# EAGLE design schema2 (EAGLE 7.7.0)
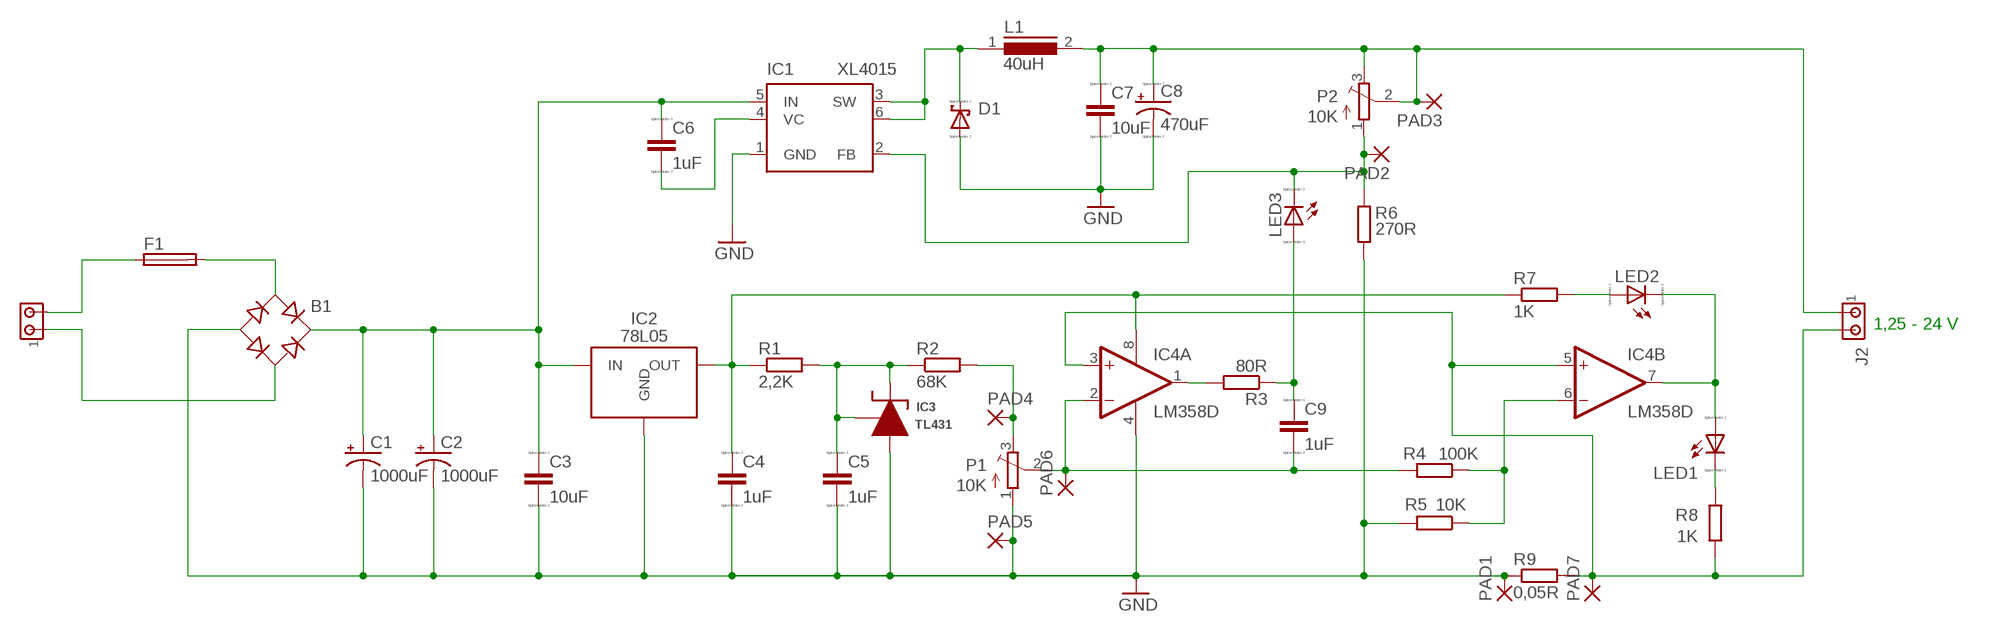
[diagram p0: schematic, sheet 1]

## Parts
B1  RECTIFIER-2KBP  [2KBP]
C1  1000uF  CPOL-USE5-10.5  [E5-10,5]
C2  1000uF  CPOL-USE5-10.5  [E5-10,5]
C3  10uF  C  [C0805]
C4  1uF  C  [C0805]
C5  1uF  C  [C0805]
C6  1uF  C  [C0805]
C7  10uF  C  [C0805]
C8  470uF  CPOL-US153CLV-0605  [153CLV-0605]
C9  1uF  C  [C0805]
D1  SCHOTTKY-DIODE  [DIODE_SMB]
F1  FUSEGSH15  [GSH15]
IC1  XL4015  [TO263-5]
IC2  78L05  78L05CPK  [SOT89]
IC3  TL431  TL431ACDBZ  [SOT-23]
IC4  LM358D  [SO08]
J1  MTA02-156  [1X2MTA]
J2  MTA02-156  [1X2MTA]
L1  40uH  ED16  [ED16]
LED1  LED_E  [LED_1206]
LED2  LED_E  [LED_1206]
LED3  LED_E  [LED_1206]
P1  10K  TRIM_EU-3223G  [3223G]
P2  10K  TRIM_EU-3223G  [3223G]
PAD1  2,15/1,0  [2,15/1,0]
PAD2  2,15/1,0  [2,15/1,0]
PAD3  2,15/1,0  [2,15/1,0]
PAD4  2,15/1,0  [2,15/1,0]
PAD5  2,15/1,0  [2,15/1,0]
PAD6  2,15/1,0  [2,15/1,0]
PAD7  2,15/1,0  [2,15/1,0]
R1  2,2K  R-EU_M0805  [M0805]
R2  68K  R-EU_M0805  [M0805]
R3  80R  R-EU_M0805  [M0805]
R4  100K  R-EU_M0805  [M0805]
R5  10K  R-EU_M0805  [M0805]
R6  270R  R-EU_M0805  [M0805]
R7  1K  R-EU_M0805  [M0805]
R8  1K  R-EU_M0805  [M0805]
R9  0,05R  RR2512  [R2512]

## Nets
GND: B1.- C1.- C2.- C3.2 C4.2 C5.2 C7.2 C8.- D1.A(C) IC1.1(GND) IC2.2(GND) IC2.2@1(GND) IC3.3(ANODE) IC4.4(P:V-) P1.1(A) PAD1.1(P) PAD5.1(P) R5.2 R6.1 R9.1
N$1: F1.1 J1.1
N$2: B1.AC1 F1.2
N$3: B1.AC2 J1.2
N$4: IC4.1(A:OUT) R3.2
N$5: C6.2 IC1.4(VC)
N$7: P1.3(E) PAD4.1(P) R2.2
N$9: C9.2 IC4.2(A:-IN) P1.2(S) PAD6.1(P) R4.2
N$10: D1.C(A) IC1.3(SW) IC1.6(SW) L1.1
N$11: C9.1 LED3.A R3.1
N$12: C7.1 C8.+ J2.2 L1.2 P2.2(S) P2.3(E) PAD3.1(P)
N$14: IC1.2(FB) LED3.C P2.1(A) PAD2.1(P) R6.2
N$15: C5.1 IC3.1(CATHODE) IC3.2(REF) R1.2 R2.1
N$16: IC4.6(B:-IN) R4.1 R5.1
N$18: LED1.C R8.2
N$19: IC4.7(B:OUT) LED1.A LED2.C
N$20: LED2.A R7.2
N$21: IC4.3(A:+IN) IC4.5(B:+IN) J2.1 PAD7.1(P) R8.1 R9.2
VCC_IN: B1.+ C1.+ C2.+ C3.1 C6.1 IC1.5(IN) IC2.3(IN)
VNN: C4.1 IC2.1(OUT) IC4.8(P:V+) R1.1 R7.1

## Notes on the sheet
- 1,25 - 24 V

## Library data of the parts
B1 = rectifier:RECTIFIER-: Rectifier
C1 C2 = adafruit:CPOL-US: POLARIZED CAPACITOR, American symbol
C3-C7 C9 = eagle-ltspice:C: CAPACITOR, European symbol; SPICEMODEL: NONE; SPICEPREFIX: C
C8 = resistor:CPOL-US: POLARIZED CAPACITOR, American symbol
D1 = eagle-ltspice:SCHOTTKY-DIODE: Schottky Diode; SPICEMODEL: NONE; SPICEPREFIX: D; SPICETYPE: diode
F1 = fuse:FUSE: Fuse; OC_FARNELL: unknown; OC_NEWARK: unknown
IC1 = moje:XL4015
IC2 = Regulators:78L05*?; MARK: B5; MF: Texas Instruments; MPN: UA78L05CPK
IC3 = TL431:TL431: Precision Shunt Regulator; MF: Texas Instruments; MPN: TL431ACDBZ
IC4 = linear:LM358: OP AMP also LM158; LM258; LM2904 Source: http://cache.national.com/ds/LM/LM158.pdf
J1 J2 = con-amp:MTA02-156: AMP connector
L1 = inductors:ED16: INDUCTOR
LED1-LED3 = eagle-ltspice:LED_E: LED Source: http://www.osram.convergy.de Source: www.luxeon.com Source: www.kingbright.com; SPICEMODEL: NONE; SPICEPREFIX: D; SPICETYPE: diode
P1 P2 = pot:TRIM_EU-: POTENTIOMETER
PAD1-PAD7 = wirepad:2,15/1,0: THROUGH-HOLE PAD
R1-R8 = resistor:R-EU_: RESISTOR, European symbol
R9 = eagle-ltspice:R: RESISTOR, European symbol; SPICEMODEL: NONE; SPICEPREFIX: R

## Board
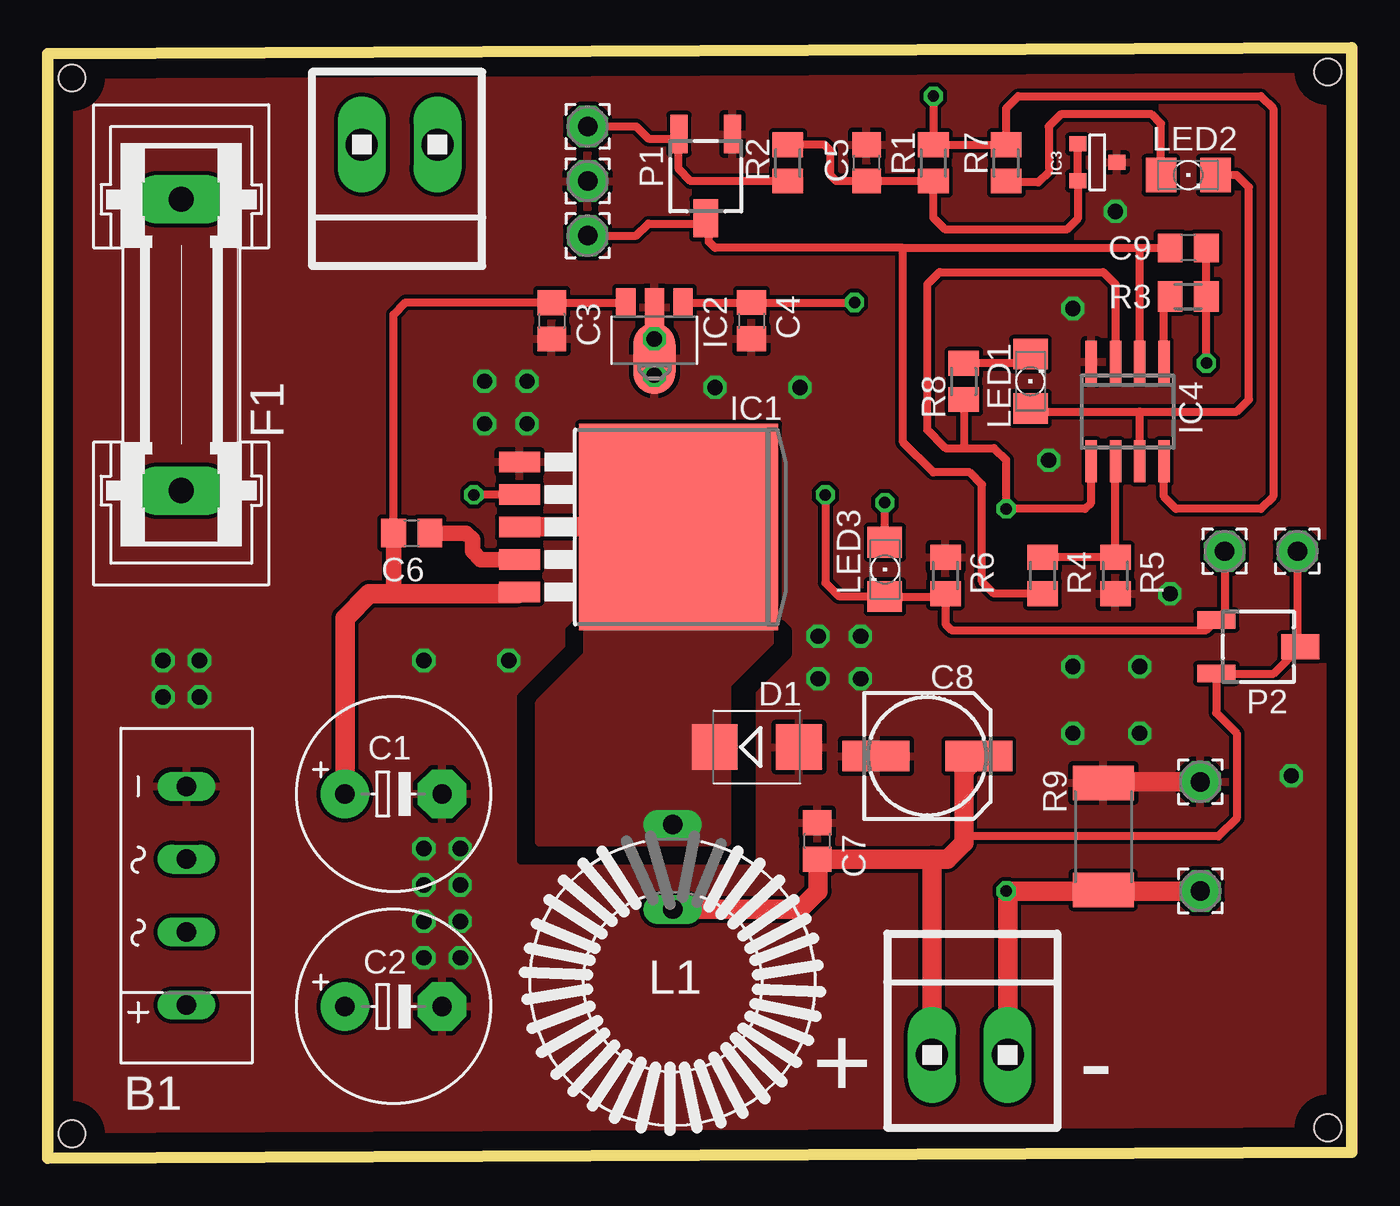
[diagram p1: board, top side]
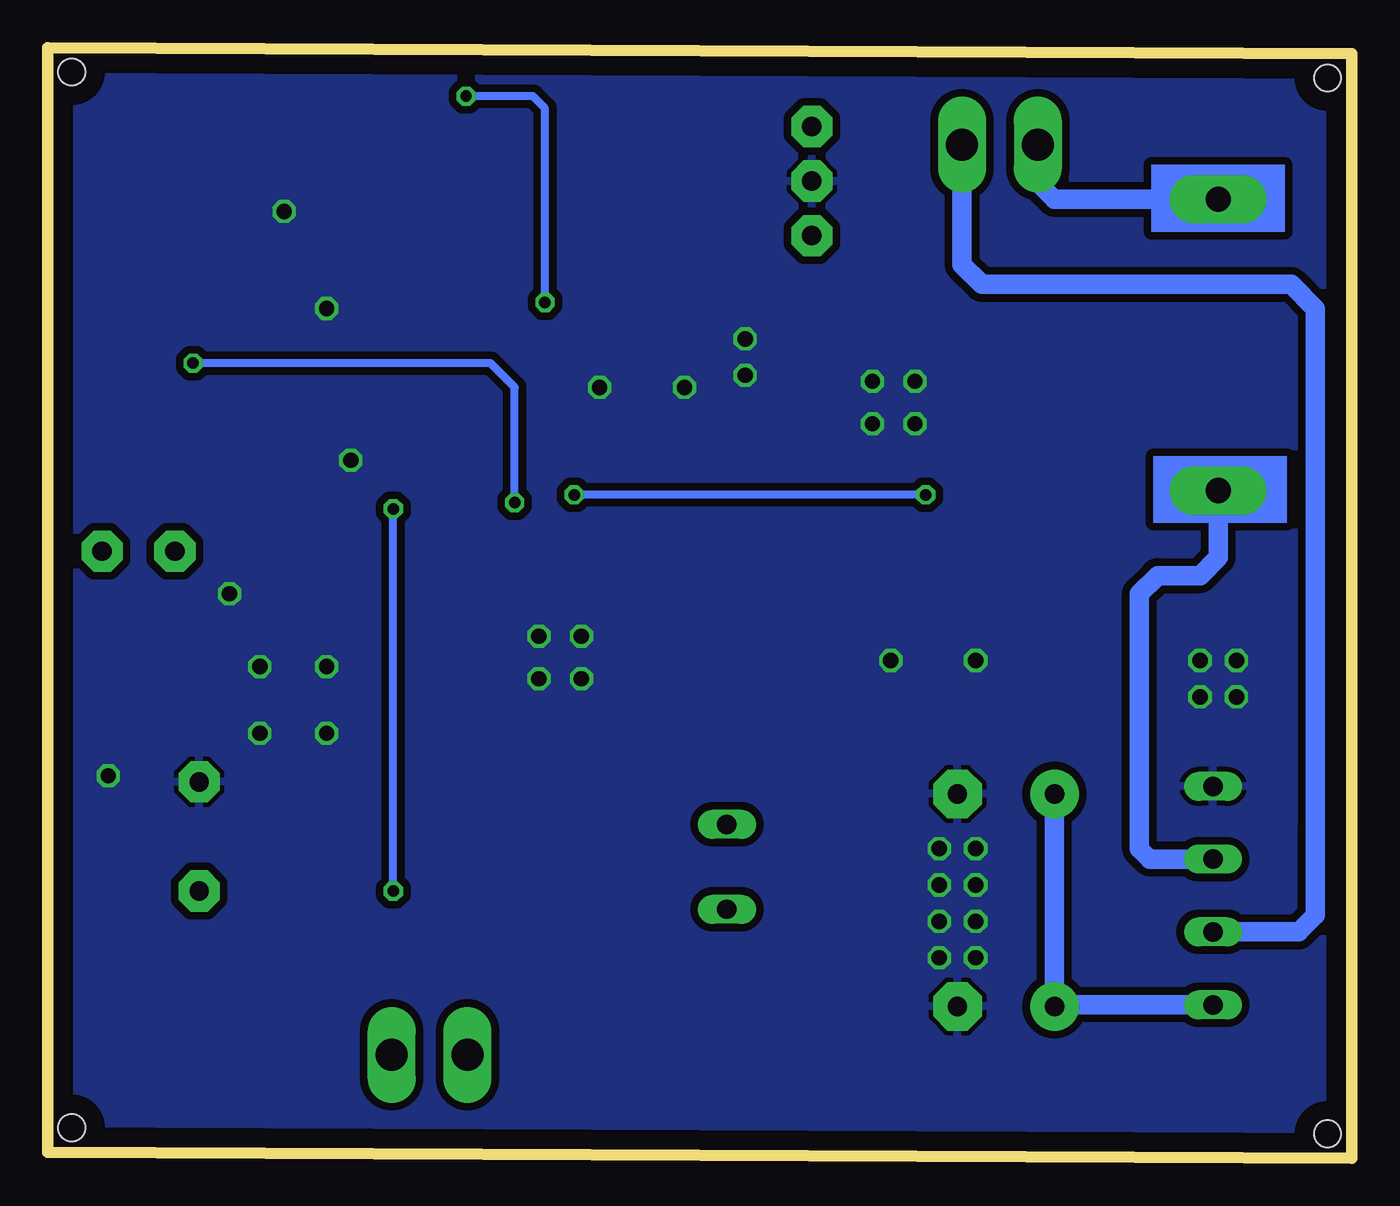
[diagram p2: board, bottom side, seen from below]

Size 68.25 x 58.09 mm. Coordinates in mm from the lower left corner, seen from the top.
Outline: 0,0 68.25,0.32 68.25,58.09 0,57.77 0,0
Copper layers (1*16): Top 0.035mm / dielectric 1.5mm / Bottom 0.035mm
Design rules "zdroj": minimum track width 10mil, minimum drill 24mil, track to track 8mil, track to pad 8mil, pad to pad 8mil, via to via 8mil, smd to smd 8mil, copper to edge 40mil, drill to drill 8mil, minimum pad ring 10mil, minimum via ring 8mil, stop-mask expansion 4mil, vias tented up to drill 0mil, thermal gap 10mil
Holes 1.4 mm at 1.27,56.52 1.27,1.27 66.99,1.59 66.99,56.83

### Footprints (pad centres in the part's own frame; a part is rotated, then mirrored left to right if it is on the bottom)
2KBP = drill 1.016 long: + 5.715,0; - -5.715,0; AC1 -1.905,0; AC2 1.905,0
E5-10,5 = drill 1.016 pad 2.54: + -2.54,0 | drill 1.016 pad 2.54 octagon: - 2.54,0
C0805 = smd 1.3 x 1.5: 1 -0.95,0; 2 0.95,0
153CLV-0605 = smd 3.5 x 1.6: + 2.7,0; - -2.7,0
DIODE_SMB = smd 2.4 x 2.4: A 2.2,0; C -2.2,0
GSH15 = drill 1.321 pad 2.54 long: 1 -7.62,0; 2 7.62,0
TO263-5 = smd 1.067 x 2.159: 1 -3.404,-5.791; 2 -1.702,-5.791; 3 0,-5.791; 4 1.702,-5.791; 5 3.404,-5.791 | smd 10.8 x 10.41: 6 0,2.54
SOT89 = smd 1 x 1.5: 1 -1.499,-1.981; 3 1.499,-1.981 | smd 1 x 2: 2 0,-1.727 | smd 2.2 x 3.7: 2@1 0,0.94
SOT-23 = smd 0.787 x 0.889: 1 -0.991,-1.016; 2 0.94,-1.016; 3 -0.025,1.016
SO08 = smd 0.6 x 2.2: 1 -1.905,-2.6; 2 -0.635,-2.6; 3 0.635,-2.6; 4 1.905,-2.6; 5 1.905,2.6; 6 0.635,2.6; 7 -0.635,2.6; 8 -1.905,2.6
1X2MTA = drill 1.676 long: 1 1.981,0; 2 -1.981,0
ED16 = drill 1.016 long: 1 -8.255,0; 2 -3.81,0
LED_1206 = smd 1.6 x 1.803: A -1.422,0; C 1.422,0
3223G = smd 2 x 0.9: 1 -2.2,1.4; 3 -2.2,-1.4 | smd 2 x 1.3: 2 2.2,0
2,15/1,0 = drill 1.016 pad 2.159 octagon: 1 0,0
M0805 = smd 1.3 x 1.6: 1 -0.95,0; 2 0.95,0
R2512 = smd 1.8 x 3.2: 1 -2.8,0; 2 2.8,0

### Placement (x,y rotation side)
B1  7.26,13.73 270 top
C1  18.1,19.05 0 top
C2  18.1,7.94 0 top
C3  26.38,43.81 270 top
C4  36.83,43.81 270 top
C5  42.86,52.07 90 top
C6  19.05,32.7 0 top
C7  40.27,16.59 90 top
C8  46.04,21.04 0 top
C9  59.69,47.62 180 top
D1  37.11,21.51 0 top
F1  6.99,42.55 270 top
IC1  30.48,33.02 270 top
IC2  31.75,42.78 180 top
IC3  54.93,52.07 270 top
IC4  56.52,39.05 180 top
J1  18.41,53.02 180 top
J2  48.26,5.4 0 top
L1  32.7,9.21 270 top
LED1  51.44,40.64 90 top
LED2  59.69,51.44 0 top
LED3  43.81,30.8 270 top
P1  34.44,51.38 270 top
P2  63.36,26.75 0 top
PAD1  60.33,19.68 0 top
PAD2  61.59,31.75 0 top
PAD3  65.41,31.75 0 top
PAD4  28.26,53.98 0 top
PAD5  28.26,51.12 0 top
PAD6  28.26,48.26 0 top
PAD7  60.33,13.97 0 top
R1  46.35,52.07 270 top
R2  38.73,52.07 270 top
R3  59.69,45.09 180 top
R4  52.07,30.48 270 top
R5  55.88,30.48 270 top
R6  46.99,30.48 270 top
R7  50.16,52.07 270 top
R8  47.94,40.64 90 top
R9  55.24,16.83 270 top

### Tracks (layer width: path | path; a pad name or v marks a point on that pad's centre or on a via)
GND  (via drill 0.8)
  Top 1.016: PAD1.1 55.3,19.68 R9.1
  other vias: 31.75,42.86 55.88,49.53 53.66,25.72 57.15,25.72 52.39,36.51 7.94,24.13 19.68,12.38 24.13,26.04 65.09,20 53.66,22.23 57.15,22.23 6.03,24.13 21.59,12.38 19.68,26.04 19.68,16.19 21.59,14.29 19.68,14.29 21.59,16.19 6.03,26.04 7.94,26.04 19.68,10.48 21.59,10.48 31.75,40.96 39.37,40.32 34.92,40.32 25.08,38.42 22.86,38.42 22.86,40.64 25.08,40.64 40.32,25.08 42.55,25.08 42.55,27.3 40.32,27.3 58.74,29.53 53.66,44.45
  pour Bottom (isolate 0.406): 0,57.78 68.26,58.1 68.26,0.32 0,0
  pour Top: 0,57.78 68.26,58.1 68.26,0.32 0,0
N$1
  Bottom 1.016: F1.1 15.56,50.16 16.51,51.12 16.51,52.95 J1.1
N$2
  Bottom 1.016: B1.AC1 10.56,15.64 11.11,16.19 11.11,29.53 10.16,30.48 7.94,30.48 6.99,31.43 F1.2
N$3
  Bottom 1.016: J1.2 20.4,46.75 19.37,45.72 3.17,45.72 1.91,44.45 1.91,18.1 1.91,17.46 1.91,12.7 2.77,11.83 B1.AC2
N$4
  Top 0.406: IC4.1 58.42,45.09 R3.2
N$5
  Top 0.813: IC1.4 22.66,31.32 22.23,31.75 22.23,32.38 21.91,32.7 C6.2
N$6
  cutout Top (isolate 1.27, no thermals): 27.62,27.94 27.62,26.67 25.08,24.13 25.08,15.88 36.2,15.88 36.2,19.68 36.51,19.68 36.51,23.18 36.2,23.18 36.2,24.45 38.42,26.67 38.42,27.94 38.73,27.62 38.73,26.35 36.83,24.45 36.83,15.56 24.77,15.56 24.77,24.13 27.3,26.67 27.3,27.62
N$7
  Top 0.406: R2.2 33.65,51.12 33.02,51.75 33.02,53.55 P1.3 32.8,53.34 31.43,53.34 30.8,53.98 PAD4.1
N$9
  Top 0.406: 44.77,47.62 57.15,47.62 | 57.15,47.62 C9.2 | IC4.2 57.15,47.62 | R4.2 49.53,29.53 48.9,30.16 48.9,35.24 48.26,35.88 46.35,35.88 44.77,37.47 44.77,47.62 | 44.77,47.62 34.92,47.62 34.61,47.94 34.61,49.01 P1.2 34.16,48.9 31.43,48.9 30.8,48.26 PAD6.1
N$10
  Top 1.016: IC1.3 IC1.6
  pour Top (isolate 1.27, no thermals): 28.26,38.1 37.78,38.1 37.78,26.99 35.56,24.77 35.56,16.51 25.72,16.51 25.72,23.81 28.26,26.35
N$11  (via drill 0.6)
  Top 0.406: LED3.A v43.81,34.29 | v60.64,41.59 R3.1 C9.1
  Bottom 0.406: v43.81,34.29 43.81,40.32 45.09,41.59 v60.64,41.59
N$12
  Top 0.406: PAD3.1 65.41,26.91 P2.2 64.16,25.35 P2.3 61.16,23.3 62.23,22.23 62.23,17.78 61.28,16.83 47.94,16.83
  Top 1.016: 48.58,20.88 C8.+ 47.94,20.24 47.94,16.83 47.94,16.51 47.08,15.64 46.28,15.64 | 46.28,15.64 C7.1 40.32,15.6 40.32,13.97 39.37,13.02 L1.2 | J2.2 46.28,15.64
N$14  (via drill 0.6)
  Top 0.406: PAD2.1 61.59,28.59 P2.1 60.63,27.62 47.31,27.62 46.99,27.94 R6.2 46.84,29.38 LED3.C 43.79,29.4 41.4,29.4 40.7,30.1 v40.7,34.7 | IC1.2 24.69,34.7 v22.3,34.7
  Bottom 0.406: v22.3,34.7 v40.7,34.7
N$15
  Top 0.406: IC3.1 IC3.2 53.91,49.15 53.34,48.58 46.99,48.58 46.35,49.21 R1.2 C5.1 41.27,51.12 40.96,51.44 40.96,52.7 40.64,53.02 R2.1
N$16
  Top 0.406: IC4.6 R5.1 R4.1
N$18
  Top 0.406: LED1.C 50.96,41.59 R8.2
N$19
  Top 0.406: 57.15,39.05 51.44,39.05 LED1.A | 57.15,39.05 62.23,39.05 62.87,39.69 62.87,50.8 62.23,51.44 LED2.C | IC4.7 57.15,39.05
N$20
  Top 0.406: LED2.A 58.27,54.13 57.78,54.61 53.02,54.61 52.39,53.98 52.39,51.59 51.84,51.05 50.24,51.05 R7.2
N$21  (via drill 0.6)
  Top 0.406: IC4.3 55.88,45.72 55.24,46.35 46.67,46.35 46.04,45.72 46.04,38.1 46.99,37.15 47.94,37.15 | IC4.5 54.61,34.29 54.29,33.97 v50.16,33.97 50.16,36.51 49.53,37.15 47.94,37.15 | R8.1 47.94,37.15 | 55.19,13.97 R9.2
  Top 1.016: 55.19,13.97 v50.16,13.97 50.24,13.97 J2.1 | PAD7.1 55.3,13.97 R9.2
  Bottom 0.406: v50.16,13.97 v50.16,33.97
VCC_IN
  Top 0.406: C6.1 18.1,44.13 18.73,44.77 26.37,44.77 C3.1 IC2.3
  Top 0.813: C6.1 18.1,29.53
  Top 1.016: C1.+ 15.56,28.26 16.83,29.53 18.1,29.53 24.6,29.53 IC1.5
  Bottom 1.016: C1.+ C2.+ 15.47,8.02 B1.+
VNN  (via drill 0.6)
  Top 0.406: IC4.8 58.42,34.61 59.05,33.97 63.5,33.97 64.14,34.61 64.14,54.93 63.5,55.56 50.8,55.56 50.16,54.93 R7.1 R1.1 v46.35,55.56 | IC2.1 C4.1 v42.23,44.77
  Bottom 0.406: v42.23,44.77 42.23,54.93 42.86,55.56 v46.35,55.56
(copper drawn outside any net)
  shapes: Bottom area x2

### Text on the board
tPlace: + | -